# EAGLE design eeprom_emu_bt_satland (EAGLE 7.6.0)
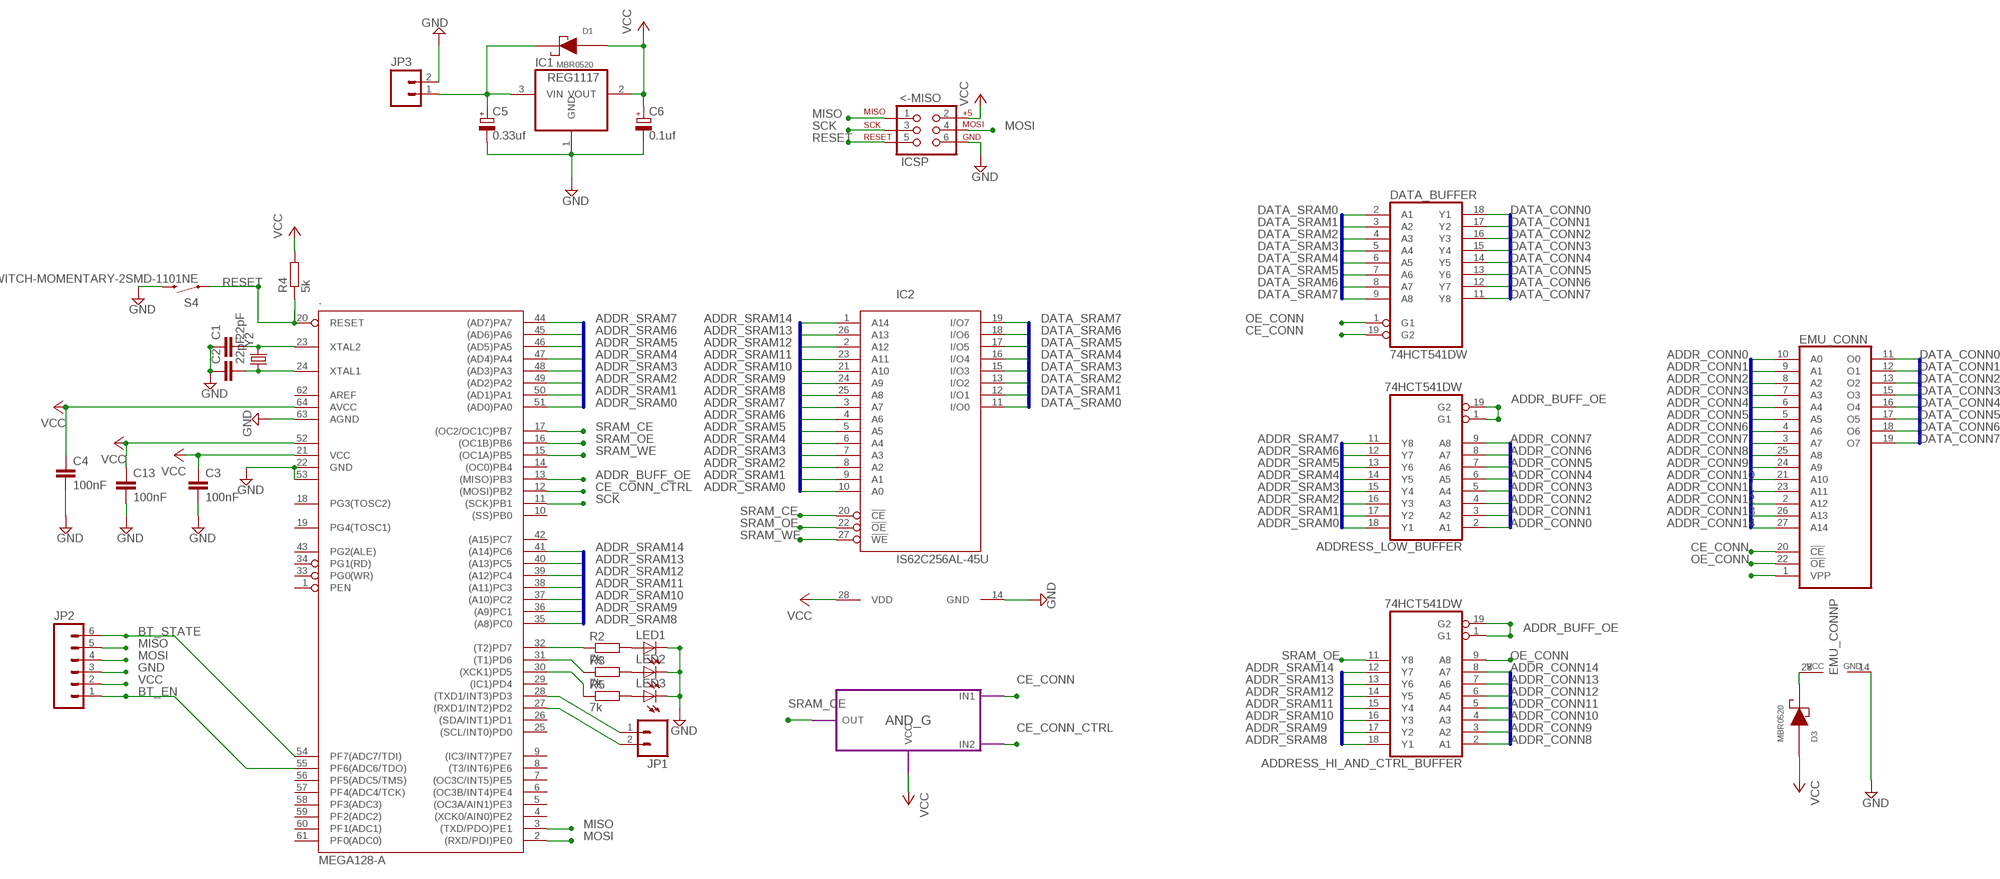
[diagram p0: schematic, sheet 1]

## Parts
.  MEGA128-A  [TQFP64]
<-MISO  ICSP  AVR_SPI_PRG_6PTH  [2X3]
ADDRESS_HI_AND_CTRL_BUFFER  74HCT541DW  [SO20W]
ADDRESS_LOW_BUFFER  74HCT541DW  [SO20W]
C1  22pF  C-EUC0805  [C0805]
C2  22pF  C-EUC0805  [C0805]
C3  100nF  C-EUC0805  [C0805]
C4  100nF  C-EUC0805  [C0805]
C5  0.33uf  CPOL-EUE5-4  [E5-4]
C6  0.1uf  CPOL-EUE5-4  [E5-4]
C13  100nF  C-EUC0805  [C0805]
D1  MBR0520  [SOD-123]
D3  MBR0520  [SOD-123]
DATA_BUFFER  74HCT541DW  [SO20W]
EMU_CONN  27256  [DIL28]
IC1  REG1117  [SOT223]
IC2  IS62C256AL-45U  [SOP28-330MIL]
JP1  M02LOCK_LONGPADS  [1X02_LOCK_LONGPADS]
JP2  M06SILK_FEMALE_PTH  [1X06]
JP3  M02LOCK_LONGPADS  [1X02_LOCK_LONGPADS]
LED1  LEDSML0805  [SML0805]
LED2  LEDSML0805  [SML0805]
LED3  LEDSML0805  [SML0805]
R2  7k  R-EU_R0805  [R0805]
R3  7k  R-EU_R0805  [R0805]
R4  5k  R-EU_R0805  [R0805]
R5  7k  R-EU_R0805  [R0805]
S4  SWITCH-MOMENTARY-2SMD-1101NE  [TACTILE-SWITCH-1101NE]
Y2  CRYSTALHC49UV  [HC49U-V]

## Module instances
AND_G = OR_GATE

## Nets
ADDR_BUFF_OE: ..13((MISO)PB3) ADDRESS_HI_AND_CTRL_BUFFER.1(G1) ADDRESS_HI_AND_CTRL_BUFFER.19(G2) ADDRESS_LOW_BUFFER.1(G1) ADDRESS_LOW_BUFFER.19(G2)
ADDR_CONN0: ADDRESS_LOW_BUFFER.2(A1) EMU_CONN.10(A0)
ADDR_CONN1: ADDRESS_LOW_BUFFER.3(A2) EMU_CONN.9(A1)
ADDR_CONN2: ADDRESS_LOW_BUFFER.4(A3) EMU_CONN.8(A2)
ADDR_CONN3: ADDRESS_LOW_BUFFER.5(A4) EMU_CONN.7(A3)
ADDR_CONN4: ADDRESS_LOW_BUFFER.6(A5) EMU_CONN.6(A4)
ADDR_CONN5: ADDRESS_LOW_BUFFER.7(A6) EMU_CONN.5(A5)
ADDR_CONN6: ADDRESS_LOW_BUFFER.8(A7) EMU_CONN.4(A6)
ADDR_CONN7: ADDRESS_LOW_BUFFER.9(A8) EMU_CONN.3(A7)
ADDR_CONN8: ADDRESS_HI_AND_CTRL_BUFFER.2(A1) EMU_CONN.25(A8)
ADDR_CONN9: ADDRESS_HI_AND_CTRL_BUFFER.3(A2) EMU_CONN.24(A9)
ADDR_CONN10: ADDRESS_HI_AND_CTRL_BUFFER.4(A3) EMU_CONN.21(A10)
ADDR_CONN11: ADDRESS_HI_AND_CTRL_BUFFER.5(A4) EMU_CONN.23(A11)
ADDR_CONN12: ADDRESS_HI_AND_CTRL_BUFFER.6(A5) EMU_CONN.2(A12)
ADDR_CONN13: ADDRESS_HI_AND_CTRL_BUFFER.7(A6) EMU_CONN.26(A13)
ADDR_CONN14: ADDRESS_HI_AND_CTRL_BUFFER.8(A7) EMU_CONN.27(A14)
ADDR_SRAM0: ..51((AD0)PA0) ADDRESS_LOW_BUFFER.18(Y1) IC2.10(A0)
ADDR_SRAM1: ..50((AD1)PA1) ADDRESS_LOW_BUFFER.17(Y2) IC2.9(A1)
ADDR_SRAM2: ..49((AD2)PA2) ADDRESS_LOW_BUFFER.16(Y3) IC2.8(A2)
ADDR_SRAM3: ..48((AD3)PA3) ADDRESS_LOW_BUFFER.15(Y4) IC2.7(A3)
ADDR_SRAM4: ..47((AD4)PA4) ADDRESS_LOW_BUFFER.14(Y5) IC2.6(A4)
ADDR_SRAM5: ..46((AD5)PA5) ADDRESS_LOW_BUFFER.13(Y6) IC2.5(A5)
ADDR_SRAM6: ..45((AD6)PA6) ADDRESS_LOW_BUFFER.12(Y7) IC2.4(A6)
ADDR_SRAM7: ..44((AD7)PA7) ADDRESS_LOW_BUFFER.11(Y8) IC2.3(A7)
ADDR_SRAM8: ..35((A8)PC0) ADDRESS_HI_AND_CTRL_BUFFER.18(Y1) IC2.25(A8)
ADDR_SRAM9: ..36((A9)PC1) ADDRESS_HI_AND_CTRL_BUFFER.17(Y2) IC2.24(A9)
ADDR_SRAM10: ..37((A10)PC2) ADDRESS_HI_AND_CTRL_BUFFER.16(Y3) IC2.21(A10)
ADDR_SRAM11: ..38((A11)PC3) ADDRESS_HI_AND_CTRL_BUFFER.15(Y4) IC2.23(A11)
ADDR_SRAM12: ..39((A12)PC4) ADDRESS_HI_AND_CTRL_BUFFER.14(Y5) IC2.2(A12)
ADDR_SRAM13: ..40((A13)PC5) ADDRESS_HI_AND_CTRL_BUFFER.13(Y6) IC2.26(A13)
ADDR_SRAM14: ..41((A14)PC6) ADDRESS_HI_AND_CTRL_BUFFER.12(Y7) IC2.1(A14)
BT_EN: ..55(PF6(ADC6/TDO)) JP2.1
BT_STATE: ..54(PF7(ADC7/TDI)) JP2.6
CE_CONN: DATA_BUFFER.19(G2) EMU_CONN.20(!CE) ; port AND_G.IN1
CE_CONN_CTRL: ..12((MOSI)PB2) ; port AND_G.IN2
DATA_CONN0: DATA_BUFFER.18(Y1) EMU_CONN.11(O0)
DATA_CONN1: DATA_BUFFER.17(Y2) EMU_CONN.12(O1)
DATA_CONN2: DATA_BUFFER.16(Y3) EMU_CONN.13(O2)
DATA_CONN3: DATA_BUFFER.15(Y4) EMU_CONN.15(O3)
DATA_CONN4: DATA_BUFFER.14(Y5) EMU_CONN.16(O4)
DATA_CONN5: DATA_BUFFER.13(Y6) EMU_CONN.17(O5)
DATA_CONN6: DATA_BUFFER.12(Y7) EMU_CONN.18(O6)
DATA_CONN7: DATA_BUFFER.11(Y8) EMU_CONN.19(O7)
DATA_SRAM0: DATA_BUFFER.2(A1) IC2.11(I/O0)
DATA_SRAM1: DATA_BUFFER.3(A2) IC2.12(I/O1)
DATA_SRAM2: DATA_BUFFER.4(A3) IC2.13(I/O2)
DATA_SRAM3: DATA_BUFFER.5(A4) IC2.15(I/O3)
DATA_SRAM4: DATA_BUFFER.6(A5) IC2.16(I/O4)
DATA_SRAM5: DATA_BUFFER.7(A6) IC2.17(I/O5)
DATA_SRAM6: DATA_BUFFER.8(A7) IC2.18(I/O6)
DATA_SRAM7: DATA_BUFFER.9(A8) IC2.19(I/O7)
GND: ..22(GND) ..53(GND1) ..63(AGND) <-MISO.6 C1.1 C2.1 C3.2 C4.2 C5.- C6.- C13.2 EMU_CONN.14(GND) IC1.1(GND) IC2.14(GND) JP2.3 JP3.2 LED1.C LED2.C LED3.C S4.2
MISO: ..3((TXD/PDO)PE1) <-MISO.1 JP2.5
MOSI: ..2((RXD/PDI)PE0) <-MISO.4 JP2.4
N$1: ..24(XTAL1) C2.2 Y2.1
N$2: ..23(XTAL2) C1.2 Y2.2
N$3: C5.+ D1.1(CA) IC1.3(VIN) JP3.1
N$4: D3.1(CA) EMU_CONN.28(VCC)
N$5: ..28((TXD1/INT3)PD3) JP1.1
N$6: ..32((T2)PD7) R2.1
N$7: LED1.A R2.2
N$8: ..31((T1)PD6) R3.1
N$9: EMU_CONN.1(VPP)
N$10: LED2.A R3.2
N$11: ..30((XCK1)PD5) R5.1
N$12: LED3.A R5.2
N$13: ..27((RXD1/INT2)PD2) JP1.2
OE_CONN: ADDRESS_HI_AND_CTRL_BUFFER.9(A8) DATA_BUFFER.1(G1) EMU_CONN.22(!OE)
RESET: ..20(RESET) <-MISO.5 R4.1 S4.1
SCK: ..11((SCK)PB1) <-MISO.3
SRAM_CE: ..17((OC2/OC1C)PB7) IC2.20(!CE) ; port AND_G.OUT
SRAM_OE: ..16((OC1B)PB6) ADDRESS_HI_AND_CTRL_BUFFER.11(Y8) IC2.22(!OE)
SRAM_WE: ..15((OC1A)PB5) IC2.27(!WE)
VCC: ..21(VCC) ..52(VCC1) ..64(AVCC) <-MISO.2 C3.1 C4.1 C6.+ C13.1 D1.2(AN) D3.2(AN) IC1.2(VOUT) IC2.28(VDD) JP2.2 R4.2 ; port AND_G.VCC
Unconnected: ..1(PEN) ..4((XCK0/AIN0)PE2) ..5((OC3A/AIN1)PE3) ..6((OC3B/INT4)PE4) ..7((OC3C/INT5)PE5) ..8((T3/INT6)PE6) ..9((IC3/INT7)PE7) ..10((SS)PB0) ..14((OC0)PB4) ..18(PG3(TOSC2)) ..19(PG4(TOSC1)) ..25((SCL/INT0)PD0) ..26((SDA/INT1)PD1) ..29((IC1)PD4) ..33(PG0(WR)) ..34(PG1(RD)) ..42((A15)PC7) ..43(PG2(ALE)) ..56(PF5(ADC5/TMS)) ..57(PF4(ADC4/TCK)) ..58(PF3(ADC3)) ..59(PF2(ADC2)) ..60(PF1(ADC1)) ..61(PF0(ADC0)) ..62(AREF)

## Buses
ADDR_SRAM[0..14]
DATA_SRAM[0..7]
DATA_CONN[0..7]
ADDR_CONN[0..7]
ADDR_CONN[8..14]
ADDR_SRAM[0..7]
ADDR_SRAM[8..14]
ADDR_CONN[0..14]

## Power pins joined to a net without a drawn wire
GND: ADDRESS_HI_AND_CTRL_BUFFER.10(GND) ADDRESS_LOW_BUFFER.10(GND) DATA_BUFFER.10(GND)
VCC: ADDRESS_HI_AND_CTRL_BUFFER.20(VCC) ADDRESS_LOW_BUFFER.20(VCC) DATA_BUFFER.20(VCC)

## Library data of the parts
. = avr-7:MEGA128: MICROCONTROLLER 128 Kbytes FLASH 4 Kbytes SRAM 4 Kbytes EEPROM DUAL USART 8-channel 10 bit ADC
<-MISO = SparkFun-Connectors:AVR_SPI_PRG_6: AVR ISP 6 Pin This is the reduced ISP connector for AVR programming. Common on Arduino. This footprint will take up less PCB space and can be used with a 10-pin to 6-pin adapter such as SKU: BOB-08508 **Special note about "TEST_POINT" package. The stop mask is on the top side, so if you want your programming test points to be on the bottom of your board, make sure to place this package on the bottom side of the board. This also ensure that the orientation to program from the bottom side will be correct.
ADDRESS_HI_AND_CTRL_BUFFER ADDRESS_LOW_BUFFER DATA_BUFFER = 74xx-eu:74*541: Octal BUFFER and LINE DRIVER, 3-state
C1-C4 C13 = resistor:C-EU: CAPACITOR, European symbol
C5 C6 = rcl:CPOL-EU: POLARIZED CAPACITOR, European symbol
D1 D3 = MySMD:MBR0520
EMU_CONN = memory:27256: MEMORY
IC1 = burr-brown:REG1117: 800mA and 1A Low Dropout (LDO) Positive Regulator 1.8V, 2.5V, 2.85V, 3.3V, 5V, and Adj; MPN: REG1117; OC_FARNELL: 1097566; OC_NEWARK: 14P6981
IC2 = memory-issi-asynsram:IS62C256AL-*: 32k x 8 low power CMOS static RAM 25ns and 45ns access time 5V power supply
JP1 JP3 = SparkFun-Connectors:M02: Standard 2-pin 0.1" header. Use with - straight break away headers ( PRT-00116) - right angle break away headers (PRT-00553) - swiss pins (PRT-00743) - machine pins (PRT-00117) - female headers (PRT-00115) Molex polarized connector foot print use with: PRT-08233 with associated crimp pins and housings. 2.54_SCREWTERM for use with PRT-10571. 3.5mm Screw Terminal footprints for PRT-08084 5mm Screw Terminal footprints for use with PRT-08432
JP2 = SparkFun-Connectors:M06: Header 6 Standard 6-pin 0.1" header. Use with straight break away headers (SKU : PRT-00116), right angle break away headers (PRT-00553), swiss pins (PRT-00743), machine pins (PRT-00117), and female headers (PRT-00115). Molex polarized connector foot print use with SKU : PRT-08094 with associated crimp pins and housings. NOTES ON THE VARIANTS LOCK and LOCK_LONGPADS... This footprint was designed to help hold the alignment of a through-hole component (i.e. 6-pin header) while soldering it into place. You may notice that each hole has been shifted either up or down by 0.005 of an inch from it's more standard position (which is a perfectly straight line). This slight alteration caused the pins (the squares in the middle) to touch the edges of the holes. Because they are alternating, it causes a "brace" to hold the component in place. 0.005 has proven to be the perfect amount of "off-center" position when using our standard breakaway headers. Although looks a little odd when you look at the bare footprint, once you have a header in there, the alteration is very hard to notice. Also,if you push a header all the way into place, it is covered up entirely on the bottom side. This idea of altering the position of holes to aid alignment will be further integrated into the Sparkfun Library for other footprints. It can help hold any component with 3 or more connection pins.; PROD_ID: CONN-08437
LED1-LED3 = led:LED: LED OSRAM: - CHIPLED LG R971, LG N971, LY N971, LG Q971, LY Q971, LO R971, LY R971 LH N974, LH R974 LS Q976, LO Q976, LY Q976 LO Q996 - Hyper CHIPLED LW Q18S LB Q993, LB Q99A, LB R99A - SideLED LS A670, LO A670, LY A670, LG A670, LP A670 LB A673, LV A673, LT A673, LW A673 LH A674 LY A675 LS A676, LA A676, LO A676, LY A676, LW A676 LS A679, LY A679, LG A679 - Hyper Micro SIDELED® LS Y876, LA Y876, LO Y876, LY Y876 LT Y87S - SmartLED LW L88C, LW L88S LB L89C, LB L89S, LG L890 LS L89K, LO L89K, LY L89K LS L896, LA L896, LO L896, LY L896 - TOPLED LS T670, LO T670, LY T670, LG T670, LP T670 LSG T670, LSP T670, LSY T670, LOP T670, LYG T670 LG T671, LOG T671, LSG T671 LB T673, LV T673, LT T673, LW T673 LH T674 LS T676, LA T676, LO T676, LY T676, LB T676, LH T676, LSB T676, LW T676 LB T67C, LV T67C, LT T67C, LS T67K, LO T67K, LY T67K, LW E67C LS E67B, LA E67B, LO E67B, LY E67B, LB E67C, LV E67C, LT E67C LW T67C LS T679, LY T679, LG T679 LS T770, LO T770, LY T770, LG T770, LP T770 LB T773, LV T773, LT T773, LW T773 LH T774 LS E675, LA E675, LY E675, LS T675 LS T776, LA T776, LO T776, LY T776, LB T776 LHGB T686 LT T68C, LB T68C - Hyper Mini TOPLED® LB M676 - Mini TOPLED Santana® LG M470 LS M47K, LO M47K, LY M47K Source: http://www.osram.convergy.de LUXEON: - LUMILED® LXK2-PW12-R00, LXK2-PW12-S00, LXK2-PW14-U00, LXK2-PW14-V00 LXK2-PM12-R00, LXK2-PM12-S00, LXK2-PM14-U00 LXK2-PE12-Q00, LXK2-PE12-R00, LXK2-PE12-S00, LXK2-PE14-T00, LXK2-PE14-U00 LXK2-PB12-K00, LXK2-PB12-L00, LXK2-PB12-M00, LXK2-PB14-N00, LXK2-PB14-P00, LXK2-PB14-Q00 LXK2-PR12-L00, LXK2-PR12-M00, LXK2-PR14-Q00, LXK2-PR14-R00 LXK2-PD12-Q00, LXK2-PD12-R00, LXK2-PD12-S00 LXK2-PH12-R00, LXK2-PH12-S00 LXK2-PL12-P00, LXK2-PL12-Q00, LXK2-PL12-R00 Source: www.luxeon.com KINGBRIGHT: KA-3528ASYC Source: www.kingbright.com
R2-R5 = rcl:R-EU_: RESISTOR, European symbol
S4 = SparkFun-Electromechanical:SWITCH-MOMENTARY-2: Various NO switches- pushbuttons, reed, etc; PROD_ID: SWCH-00815
Y2 = SparkFun-FreqCtrl:CRYSTAL: Various standard crystals. Proven footprints.

## Module OR_GATE
Ports: IN1(in) IN2(in) VCC(pwr) OUT(out)
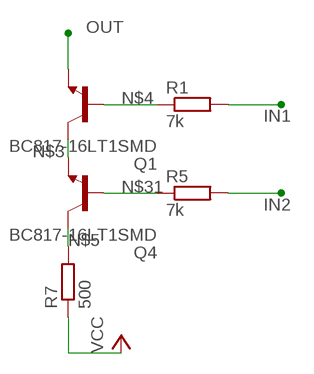
[diagram p1: schematic, module OR_GATE, sheet 1]

### Parts
Q1  BC817-16LT1SMD  [SOT23-BEC]
Q4  BC817-16LT1SMD  [SOT23-BEC]
R1  7k  R-EU_R0805  [R0805]
R5  7k  R-EU_R0805  [R0805]
R7  500  R-EU_R0805  [R0805]

### Nets
IN1: R1.2
IN2: R5.2
N$3: Q1.C Q4.E
N$4: Q1.B R1.1
N$5: Q4.C R7.2
N$31: Q4.B R5.1
OUT: Q1.E
VCC: R7.1

### Library data of the parts
Q1 Q4 = transistor-npn:BC817*: NPN Transistor
R1 R5 R7 = rcl:R-EU_: RESISTOR, European symbol

## Board
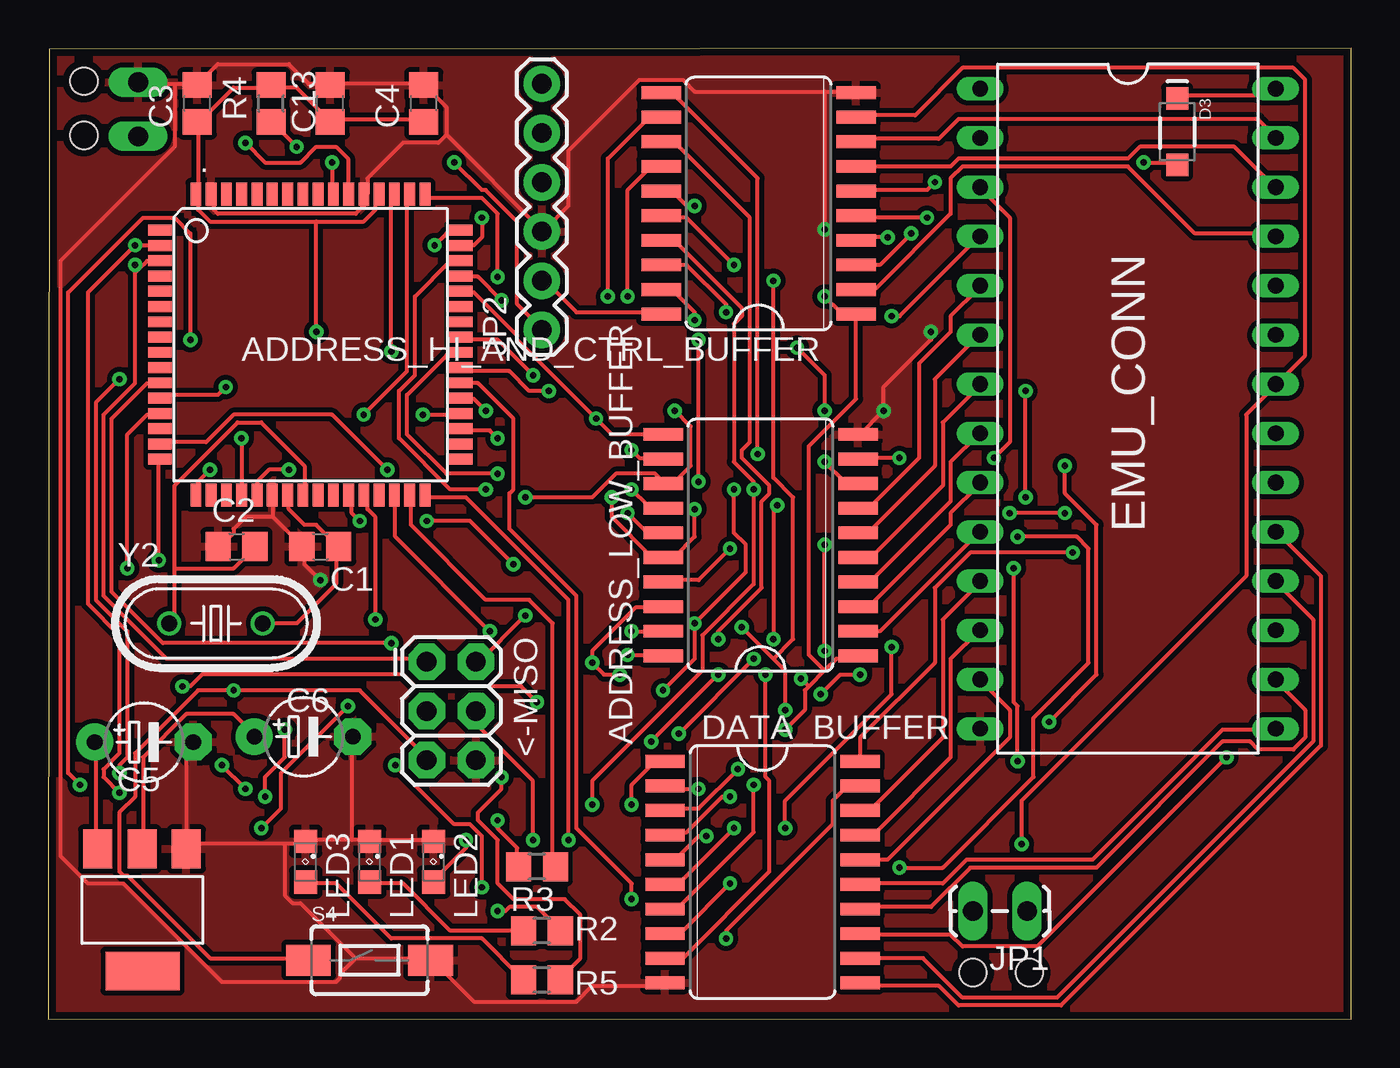
[diagram p2: board, top side]
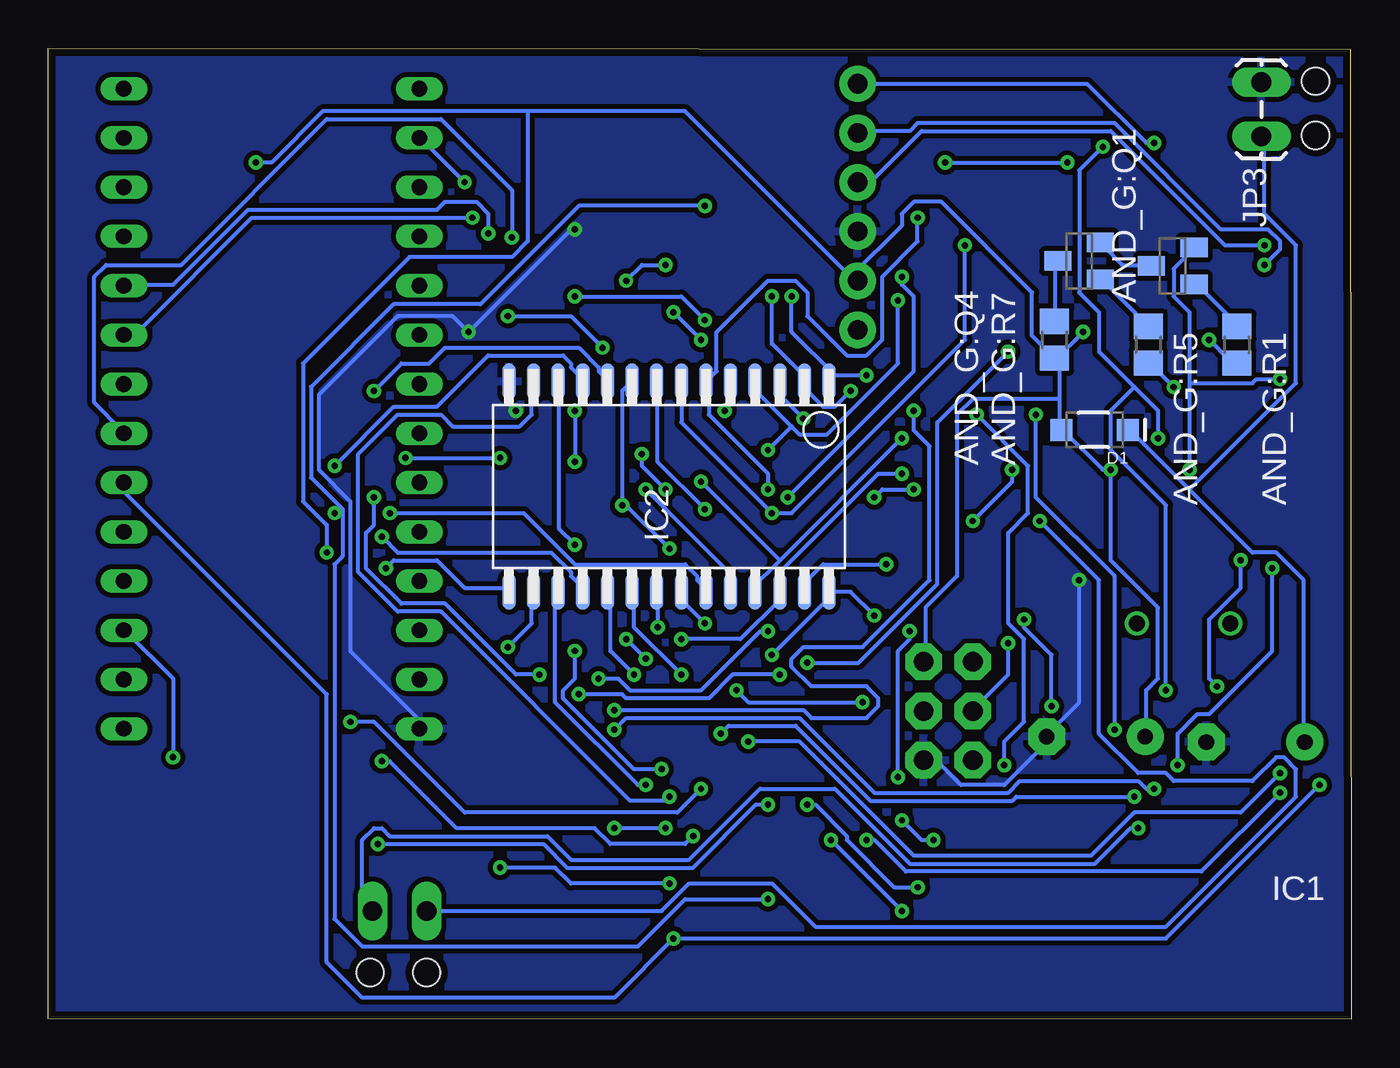
[diagram p3: board, bottom side, seen from below]

Size 67.18 x 50.08 mm. Coordinates in mm from the lower left corner, seen from the top.
Outline: 0,0 67.18,0.02 67.18,50.08 0.05,50.03 0,0
Copper layers (1*16): Top 0.0356mm / dielectric 1.5011mm / Bottom 0.0356mm
Design rules "oshpark-2layer *": minimum track width 8mil, minimum drill 13mil, track to track 8mil, track to pad 8mil, pad to pad 8mil, via to via 8mil, smd to smd 6mil, copper to edge 15mil, drill to drill 6mil, minimum pad ring 8mil, minimum via ring 8mil, stop-mask expansion 2.5mil, vias tented up to drill 0mil, thermal gap 10mil
Holes 1.4 mm at 1.83,48.39 1.83,45.59 47.68,2.41 50.6,2.41

### Footprints (pad centres in the part's own frame; a part is rotated, then mirrored left to right if it is on the bottom)
TQFP64 = smd 1.194 x 0.559: 1 -7.76,5.905; 2 -7.76,5.118; 3 -7.76,4.331; 4 -7.76,3.543; 5 -7.76,2.756; 6 -7.76,1.968; 7 -7.76,1.181; 8 -7.76,0.394; 9 -7.76,-0.394; 10 -7.76,-1.181; 11 -7.76,-1.968; 12 -7.76,-2.756; 13 -7.76,-3.543; 14 -7.76,-4.331; 15 -7.76,-5.118; 16 -7.76,-5.905; 33 7.76,-5.905; 34 7.76,-5.118; 35 7.76,-4.331; 36 7.76,-3.543; 37 7.76,-2.756; 38 7.76,-1.968; 39 7.76,-1.181; 40 7.76,-0.394; 41 7.76,0.394; 42 7.76,1.181; 43 7.76,1.968; 44 7.76,2.756; 45 7.76,3.543; 46 7.76,4.331; 47 7.76,5.118; 48 7.76,5.905 | smd 0.559 x 1.194: 17 -5.905,-7.76; 18 -5.118,-7.76; 19 -4.331,-7.76; 20 -3.543,-7.76; 21 -2.756,-7.76; 22 -1.968,-7.76; 23 -1.181,-7.76; 24 -0.394,-7.76; 25 0.394,-7.76; 26 1.181,-7.76; 27 1.968,-7.76; 28 2.756,-7.76; 29 3.543,-7.76; 30 4.331,-7.76; 31 5.118,-7.76; 32 5.905,-7.76; 49 5.905,7.76; 50 5.118,7.76; 51 4.331,7.76; 52 3.543,7.76; 53 2.756,7.76; 54 1.968,7.76; 55 1.181,7.76; 56 0.394,7.76; 57 -0.394,7.76; 58 -1.181,7.76; 59 -1.968,7.76; 60 -2.756,7.76; 61 -3.543,7.76; 62 -4.331,7.76; 63 -5.118,7.76; 64 -5.905,7.76
2X3 = drill 1.016 pad 1.88 octagon: 1 0,0; 2 0,2.54; 3 2.54,0; 4 2.54,2.54; 5 5.08,0; 6 5.08,2.54
SO20W = smd 0.66 x 2.032: 1 -5.715,-5.029; 2 -4.445,-5.029; 3 -3.175,-5.029; 4 -1.905,-5.029; 5 -0.635,-5.029; 6 0.635,-5.029; 7 1.905,-5.029; 8 3.175,-5.029; 9 4.445,-5.029; 10 5.715,-5.029; 11 5.715,5.029; 12 4.445,5.029; 13 3.175,5.029; 14 1.905,5.029; 15 0.635,5.029; 16 -0.635,5.029; 17 -1.905,5.029; 18 -3.175,5.029; 19 -4.445,5.029; 20 -5.715,5.029
SOT23-BEC = smd 1 x 1.4: B -0.95,-1.1; C 0,1.1; E 0.95,-1.1
R0805 = smd 1.3 x 1.5: 1 -0.95,0; 2 0.95,0
C0805 = smd 1.3 x 1.5: 1 -0.95,0; 2 0.95,0
E5-4 = drill 0.813 pad 1.905: + -2.54,0 | drill 0.813 pad 1.905 octagon: - 2.54,0
SOD-123 = smd 1.143 x 1.143: 1 0,0; 2 3.429,0
DIL28 = drill 0.813 long: 1 -16.51,-7.62; 2 -13.97,-7.62; 3 -11.43,-7.62; 4 -8.89,-7.62; 5 -6.35,-7.62; 6 -3.81,-7.62; 7 -1.27,-7.62; 8 1.27,-7.62; 9 3.81,-7.62; 10 6.35,-7.62; 11 8.89,-7.62; 12 11.43,-7.62; 13 13.97,-7.62; 14 16.51,-7.62; 15 16.51,7.62; 16 13.97,7.62; 17 11.43,7.62; 18 8.89,7.62; 19 6.35,7.62; 20 3.81,7.62; 21 1.27,7.62; 22 -1.27,7.62; 23 -3.81,7.62; 24 -6.35,7.62; 25 -8.89,7.62; 26 -11.43,7.62; 27 -13.97,7.62; 28 -16.51,7.62
SOT223 = smd 1.499 x 2.007: 1 -2.261,-3.15; 2 0.025,-3.15; 3 2.311,-3.15 | smd 3.81 x 2.007: 4 0,3.15
SOP28-330MIL = smd 0.7 x 1.9: 1 -8.255,-5.415; 2 -6.985,-5.415; 3 -5.715,-5.415; 4 -4.445,-5.415; 5 -3.175,-5.415; 6 -1.905,-5.415; 7 -0.635,-5.415; 8 0.635,-5.415; 9 1.905,-5.415; 10 3.175,-5.415; 11 4.445,-5.415; 12 5.715,-5.415; 13 6.985,-5.415; 14 8.255,-5.415; 15 8.255,5.415; 16 6.985,5.415; 17 5.715,5.415; 18 4.445,5.415; 19 3.175,5.415; 20 1.905,5.415; 21 0.635,5.415; 22 -0.635,5.415; 23 -1.905,5.415; 24 -3.175,5.415; 25 -4.445,5.415; 26 -5.715,5.415; 27 -6.985,5.415; 28 -8.255,5.415
1X02_LOCK_LONGPADS = drill 1.016 long: 1 -0.127,0; 2 2.667,0
1X06 = drill 1.016 pad 1.88: 1 0,0; 2 2.54,0; 3 5.08,0; 4 7.62,0; 5 10.16,0; 6 12.7,0
SML0805 = smd 1.2 x 1.2: A 1.05,0; C -1.05,0
TACTILE-SWITCH-1101NE = smd 2.3 x 1.6: 1 -3.15,0; 2 3.15,0
HC49U-V = drill 0.813: 1 -2.413,0; 2 2.413,0

### Placement (x,y rotation side)
.  13.51,34.8 0 top
<-MISO  19.51,18.44 270 top
ADDRESS_HI_AND_CTRL_BUFFER  36.63,42.09 90 top
ADDRESS_LOW_BUFFER  36.73,24.46 90 top
AND_G:Q1  BC817-16LT1SMD  [SOT23-BEC]  9.19,38.86 90 bottom
AND_G:Q4  BC817-16LT1SMD  [SOT23-BEC]  14.02,39.12 90 bottom
AND_G:R1  7k  [R0805]  5.89,34.8 270 bottom
AND_G:R5  7k  [R0805]  10.46,34.8 270 bottom
AND_G:R7  500  [R0805]  15.29,35.05 90 bottom
C1  14.02,24.38 0 top
C2  9.7,24.38 0 top
C3  7.67,47.24 90 top
C4  19.35,47.24 90 top
C5  4.93,14.3 0 top
C6  13.16,14.58 0 top
C13  14.53,47.24 90 top
D1  11.51,30.4 180 bottom
D3  58.22,47.5 270 top
DATA_BUFFER  36.83,7.59 270 top
EMU_CONN  55.68,31.5 270 top
IC1  4.85,5.64 180 top
IC2  35.18,27.48 180 bottom
JP1  50.34,5.59 180 top
JP2  25.45,35.56 90 top
JP3  4.62,45.67 90 bottom
LED1  16.56,8.13 270 top
LED2  19.86,8.13 270 top
LED3  13.26,8.13 270 top
R2  25.45,4.57 180 top
R3  25.2,7.87 180 top
R4  11.48,47.24 90 top
R5  25.45,2.03 180 top
S4  16.56,3.05 0 top
Y2  8.64,20.42 0 top

### Tracks (layer width: path | path; a pad name or v marks a point on that pad's centre or on a via)
ADDR_BUFF_OE  (via drill 0.33)
  Top 0.203: v4.06,23.27 4.06,30.17 5.08,31.19 5.69,31.19 ..13 | v10.16,11.89 v8.94,13.11 | v38,14.93 39.01,15.95 39.01,16.97 39.22,17.17 | 40.03,17.98 40.64,18.59 41.66,18.59 ADDRESS_LOW_BUFFER.1 | 40.03,17.98 39.22,17.17 | v30.07,20.02 ADDRESS_LOW_BUFFER.19 | 39.22,17.17 v38.81,17.58 | 40.03,17.98 39.22,18.8 39.22,29.57 41.66,32 ADDRESS_HI_AND_CTRL_BUFFER.1 41.66,36.47 40.84,36.47 v40.03,37.29 | v33.32,36.07 33.32,36.47 32.31,37.49 31.7,37.49 ADDRESS_HI_AND_CTRL_BUFFER.19
  Bottom 0.203: v4.06,23.27 4.06,19 7.31,15.75 7.92,15.75 8.94,14.73 v8.94,13.11 | v10.16,11.89 10.57,11.89 10.97,12.29 17.07,12.29 17.68,11.68 24.59,11.68 28.45,15.55 37.39,15.55 v38,14.93 | v30.07,20.02 30.48,20.02 33.53,16.97 37.19,16.97 37.79,17.58 v38.81,17.58 | v33.32,36.07 34.54,37.29 v40.03,37.29
ADDR_CONN0
  Top 0.203: ADDRESS_LOW_BUFFER.2 42.87,20.02 47.95,25.09 EMU_CONN.10
ADDR_CONN1
  Top 0.203: ADDRESS_LOW_BUFFER.3 41.86,21.44 42.47,21.44 46.53,25.5 46.53,26.11 47.95,27.53 EMU_CONN.9
ADDR_CONN2
  Top 0.203: ADDRESS_LOW_BUFFER.4 41.86,22.66 42.47,22.66 46.53,26.72 46.53,28.75 47.95,30.17 EMU_CONN.8
ADDR_CONN3
  Top 0.203: ADDRESS_LOW_BUFFER.5 41.86,23.88 42.47,23.88 46.13,27.53 46.13,30.78 47.95,32.61 EMU_CONN.7
ADDR_CONN4
  Top 0.203: ADDRESS_LOW_BUFFER.6 42.27,25.09 45.72,28.55 45.72,33.02 47.95,35.26 EMU_CONN.6
ADDR_CONN5
  Top 0.203: ADDRESS_LOW_BUFFER.7 41.86,26.52 42.47,26.52 44.91,28.96 44.91,33.83 46.53,35.46 46.53,36.27 47.95,37.69 EMU_CONN.5
ADDR_CONN6  (via drill 0.33)
  Top 0.203: v40.03,28.75 41.05,27.74 41.66,27.74 ADDRESS_LOW_BUFFER.8 | v40.03,31.39 40.03,33.22 v38.61,34.65 | v43.48,36.27 43.89,36.27 47.95,40.34 EMU_CONN.4
  Bottom 0.203: v40.03,31.39 v40.03,28.75 | v38.61,34.65 40.23,36.27 v43.48,36.27
ADDR_CONN7  (via drill 0.33)
  Top 0.203: v43.89,28.96 41.86,28.96 ADDRESS_LOW_BUFFER.9 | v48.77,28.96 49.58,29.77 49.58,41.35 48.16,42.77 EMU_CONN.3
  Bottom 0.203: v48.77,28.96 v43.89,28.96
ADDR_CONN8
  Top 0.203: ADDRESS_HI_AND_CTRL_BUFFER.2 41.66,37.69 42.67,37.69 46.53,41.55 46.53,43.38 47.14,43.99 55.68,43.99 59.13,40.54 63.19,40.54 EMU_CONN.25
ADDR_CONN9  (via drill 0.33)
  Top 0.203: ADDRESS_HI_AND_CTRL_BUFFER.3 42.87,38.91 v44.5,40.54
  Bottom 0.203: v44.5,40.54 44.5,41.55 45.11,42.16 46.74,42.16 47.14,41.76 56.9,41.76 60.76,37.9 63.19,37.9 EMU_CONN.24
ADDR_CONN10  (via drill 0.33)
  Top 0.203: v43.28,40.34 41.66,40.34 ADDRESS_HI_AND_CTRL_BUFFER.4
  Bottom 0.203: v43.28,40.34 43.28,42.77 46.94,46.43 52.83,46.43 60.35,38.91 64.21,38.91 64.82,38.3 64.82,31.8 63.4,30.38 EMU_CONN.21
ADDR_CONN11  (via drill 0.33)
  Top 0.203: v45.31,41.35 41.66,41.35 ADDRESS_HI_AND_CTRL_BUFFER.5
  Bottom 0.203: v45.31,41.35 56.69,41.35 62.59,35.46 63.19,35.46 EMU_CONN.23
ADDR_CONN12  (via drill 0.33)
  Top 0.203: v45.72,43.18 45.31,42.77 41.66,42.77 ADDRESS_HI_AND_CTRL_BUFFER.6
  Bottom 0.203: v45.72,43.18 47.95,45.41 EMU_CONN.2
ADDR_CONN13
  Top 0.203: ADDRESS_HI_AND_CTRL_BUFFER.7 46.53,43.99 46.94,44.4 55.68,44.4 56.29,45.01 61.16,45.01 63.19,42.98 EMU_CONN.26
ADDR_CONN14
  Top 0.203: ADDRESS_HI_AND_CTRL_BUFFER.8 41.66,45.41 45.92,45.41 46.94,46.43 62.38,46.43 63.19,45.62 EMU_CONN.27
ADDR_SRAM0  (via drill 0.33)
  Top 0.203: v17.68,34.44 17.68,42.37 ..51 | ADDRESS_LOW_BUFFER.18 31.7,21.23 30.28,21.23 28.04,19 v28.04,18.39 28.65,17.78 v29.46,17.78 | v50.39,26.92 v50.39,32.41 | v41.86,17.78 40.84,17.78 v39.83,16.76
  Bottom 0.203: v17.68,34.44 21.34,30.78 21.34,22.45 25.4,18.39 v28.04,18.39 | v50.39,32.41 48.97,33.83 47.55,33.83 46.74,34.65 39.83,34.65 38.81,33.63 38.81,33.43 38.4,33.02 IC2.10 | v50.39,26.92 50.39,25.5 50.8,25.09 50.8,23.27 48.97,21.44 46.74,21.44 43.08,17.78 v41.86,17.78 | v39.83,16.76 37.59,16.76 37.39,16.56 33.12,16.56 31.9,17.78 v29.46,17.78
ADDR_SRAM1  (via drill 0.33)
  Top 0.203: v16.26,31.19 18.49,33.43 18.49,42.37 ..50 | v12.19,14.93 12.19,13.51 11.18,12.5 v11.18,11.48 | v36.37,18.59 v32.51,14.73 | v37.39,19.61 37.39,26.31 v37.59,26.52 | v35.15,24.28 33.53,22.66 31.7,22.66 ADDRESS_LOW_BUFFER.17
  Bottom 0.203: v16.26,31.19 16.26,26.92 12.19,22.86 v12.19,14.93 | v11.18,11.48 17.27,11.48 17.47,11.28 24.79,11.28 28.65,15.14 32.11,15.14 v32.51,14.73 | v37.39,19.61 v36.37,18.59 | 37.59,26.72 37.59,32.41 37.19,32.82 IC2.9 | 37.59,26.72 v35.15,24.28 | 37.59,26.72 v37.59,26.52
ADDR_SRAM2  (via drill 0.33)
  Top 0.203: v23.16,38.3 23.16,41.55 22.35,42.37 19.51,42.37 ..49 | v29.06,26.92 29.06,25.91 31.09,23.88 31.7,23.88 | v33.32,26.31 33.32,24.89 32.31,23.88 31.7,23.88 | 31.7,23.88 ADDRESS_LOW_BUFFER.16
  Bottom 0.203: v23.16,38.3 23.16,37.9 22.55,37.29 22.55,33.43 v29.06,26.92 | v33.32,26.31 35.76,28.75 35.76,32.82 IC2.8
ADDR_SRAM3  (via drill 0.33)
  Top 0.203: v19.91,39.93 20.52,40.54 21.13,40.54 ..48 | ADDRESS_LOW_BUFFER.15 30.89,25.09 v29.87,26.11
  Bottom 0.203: v19.91,39.93 19.91,35.05 28.85,26.11 v29.87,26.11 34.54,30.78 IC2.7
ADDR_SRAM4  (via drill 0.33)
  Top 0.203: v22.35,41.35 22.35,40.34 21.95,39.93 21.34,39.93 ..47 | v30.07,27.33 30.89,26.52 31.7,26.52 ADDRESS_LOW_BUFFER.14
  Bottom 0.203: v22.35,41.35 22.35,40.13 24.18,38.3 24.18,35.05 24.99,34.24 26.01,34.24 28.04,36.27 28.04,37.49 28.65,38.1 30.07,38.1 32.71,35.46 32.71,33.43 33.12,33.02 IC2.6 33.12,32.82 33.12,31.19 30.07,28.14 v30.07,27.33
ADDR_SRAM5  (via drill 0.33)
  Top 0.203: v22.55,27.33 20.73,27.33 18.08,29.97 18.08,32.41 18.9,33.22 18.9,37.29 20.73,39.12 21.13,39.12 ..46 | v24.59,26.92 28.04,26.92 29.26,28.14 31.29,28.14 31.7,27.74 | v32.31,31.39 33.12,30.58 33.12,28.55 32.31,27.74 31.7,27.74 | 31.7,27.74 ADDRESS_LOW_BUFFER.13
  Bottom 0.203: v22.55,27.33 24.18,27.33 v24.59,26.92 | v32.31,31.39 32.11,31.6 32.11,32.82 IC2.5
ADDR_SRAM6  (via drill 0.33)
  Top 0.203: v23.37,37.08 22.15,38.3 21.34,38.3 ..45 | v30.07,29.36 30.48,28.96 31.7,28.96 ADDRESS_LOW_BUFFER.12
  Bottom 0.203: v23.37,37.08 23.37,33.83 27.03,30.17 28.45,30.17 28.85,30.58 | 28.85,30.58 30.68,32.41 30.68,32.82 IC2.4 | 28.85,30.58 v30.07,29.36
ADDR_SRAM7  (via drill 0.33)
  Top 0.203: ADDRESS_LOW_BUFFER.11 29.06,30.17 v28.24,30.99 24.18,35.05 24.18,35.26 21.95,37.49 21.34,37.49 ..44
  Bottom 0.203: IC2.3 29.46,32.21 v28.24,30.99
ADDR_SRAM8  (via drill 0.33)
  Top 0.203: v23.16,29.97 22.76,30.38 21.34,30.38 ..35 | ADDRESS_HI_AND_CTRL_BUFFER.18 32.92,38.91 34.95,36.88 v34.95,36.47 | v33.53,27.74 v33.53,35.05
  Bottom 0.203: 29.46,23.67 30.89,22.25 IC2.25 | 29.46,23.67 v23.16,29.97 | v33.53,35.05 v34.95,36.47 | 29.46,23.67 v33.53,27.74
ADDR_SRAM9  (via drill 0.33)
  Top 0.203: v19.3,31.19 21.13,31.19 ..36 | v17.88,13.11 20.93,10.06 21.74,10.06 22.35,9.45 v22.35,6.81 | v28.04,11.07 28.04,12.29 33.73,17.98 33.73,19.81 36.37,22.45 v36.37,27.33 36.37,27.74 35.36,28.75 35.36,35.87 35.76,36.27 35.76,36.68 32.31,40.13 31.7,40.13 ADDRESS_HI_AND_CTRL_BUFFER.17
  Bottom 0.203: v19.3,31.19 16.66,28.55 16.66,26.11 17.68,25.09 17.68,20.42 16.87,19.61 16.87,15.34 17.88,14.33 v17.88,13.11 | v22.35,6.81 23.57,6.81 26.01,9.25 26.01,9.45 27.63,11.07 v28.04,11.07 | v36.37,27.33 32.11,23.06 32.11,22.25 IC2.24
ADDR_SRAM10  (via drill 0.33)
  Top 0.203: v22.55,31.39 21.95,32 21.34,32 ..37 | v38,15.95 38,17.98 37.39,18.59 | v35.76,20.22 37.39,18.59 | v35.36,38.91 32.92,41.35 31.7,41.35 ADDRESS_HI_AND_CTRL_BUFFER.16 | v37.39,38.1 37.39,27.94 38.4,26.92 38.4,19.61 37.39,18.59
  Bottom 0.203: v22.55,31.39 22.55,30.38 21.74,29.57 21.74,22.66 25.2,19.2 28.24,19.2 28.85,18.59 28.85,18.19 27.84,17.17 24.99,17.17 24.38,16.56 24.38,16.15 24.99,15.55 27.84,15.55 28.24,15.95 v38,15.95 | v35.76,20.22 35.76,22.05 IC2.21 | v35.36,38.91 36.58,38.91 v37.39,38.1
ADDR_SRAM11  (via drill 0.33)
  Top 0.203: v30.07,6.2 30.07,7.01 27.23,9.85 27.23,21.84 23.77,25.3 23.77,27.13 23.98,27.33 23.98,30.99 22.15,32.82 21.34,32.82 ..38 | v33.32,41.96 32.92,41.96 32.31,42.57 31.7,42.57 ADDRESS_HI_AND_CTRL_BUFFER.15 | v52.43,26.11 v49.58,26.11
  Bottom 0.203: v30.07,6.2 34.34,6.2 36.78,3.76 51,3.76 52.43,5.18 52.43,23.47 52.02,23.88 52.02,26.11 | 52.02,26.11 52.02,26.31 53.64,27.94 53.64,32.61 49.38,36.88 44.91,36.88 39.83,41.96 v33.32,41.96 | v49.58,26.11 42.67,26.11 40.03,23.47 34.34,23.47 33.73,22.86 33.73,22.66 33.32,22.25 IC2.23 | 52.02,26.11 v52.43,26.11
ADDR_SRAM12  (via drill 0.33)
  Top 0.203: v25.81,32.41 24.79,32.41 23.77,33.43 21.34,33.43 ..39 | ADDRESS_HI_AND_CTRL_BUFFER.14 31.09,43.99 29.87,42.77 v29.87,37.29
  Bottom 0.203: v25.81,32.41 26.62,31.6 27.23,31.6 28.04,32.41 28.04,32.82 IC2.2 28.04,33.02 29.87,34.85 v29.87,37.29
ADDR_SRAM13  (via drill 0.33)
  Top 0.203: v23.16,28.14 20.52,28.14 18.49,30.17 18.49,32.21 20.52,34.24 21.13,34.24 ..40 | v34.54,19.61 34.54,20.02 36.78,22.25 36.78,26.72 37.19,27.13 37.19,27.53 35.76,28.96 35.76,29.36 36.17,29.77 36.17,41.35 32.31,45.21 31.7,45.21 ADDRESS_HI_AND_CTRL_BUFFER.13
  Bottom 0.203: v23.16,28.14 24.38,28.14 29.46,23.06 IC2.26 29.46,21.64 31.5,19.61 v34.54,19.61
ADDR_SRAM14  (via drill 0.33)
  Top 0.203: v24.99,33.22 23.16,35.05 21.34,35.05 ..41 | v28.85,37.29 28.85,44.4 30.89,46.43 31.5,46.43 ADDRESS_HI_AND_CTRL_BUFFER.12
  Bottom 0.203: 26.62,33.22 v24.99,33.22 | 26.62,33.22 26.82,33.02 IC2.1 26.62,33.22 | v28.85,37.29 28.85,35.46 26.62,33.22
AND_G:N$3
  Bottom 0.203: AND_G:Q1.C 10.36,38.91 11.79,38.91 12.8,39.93 AND_G:Q4.E
AND_G:N$4
  Bottom 0.203: AND_G:Q1.B 7.92,37.9 5.89,35.87 AND_G:R1.1
AND_G:N$5
  Bottom 0.203: AND_G:Q4.C 15.24,39.12 15.24,36.07 AND_G:R7.2
AND_G:N$31
  Bottom 0.203: AND_G:Q4.B 12.8,38.1 10.57,35.87 AND_G:R5.1
BT_EN  (via drill 0.33)
  Top 0.203: v14.63,44.2 14.63,42.57 ..55 | v20.93,44.2 22.35,42.77 22.55,42.77 24.18,41.15 24.18,36.88 25.4,35.66 JP2.1
  Bottom 0.203: v20.93,44.2 v14.63,44.2
BT_STATE  (via drill 0.33)
  Top 0.203: v10.16,45.21 11.18,44.2 13,44.2 13.82,45.01 14.83,45.01 15.44,44.4 15.44,42.57 ..54
  Bottom 0.203: v10.16,45.21 10.57,45.21 13.61,48.26 JP2.6
CE_CONN  (via drill 0.33)
  Top 0.203: v7.31,35.05 7.31,40.54 6.5,41.35 4.88,41.35 1.02,37.49 1.02,12.7 v1.63,12.09 | v34.95,4.17 34.95,4.57 40.44,10.06 40.44,11.28 41.05,11.89 41.86,11.89 DATA_BUFFER.19
  Bottom 0.203: v7.31,35.05 6.3,34.04 5.89,34.04 AND_G:R1.2 | v1.63,12.09 9.55,4.17 v34.95,4.17 38,1.12 51,1.12 52.83,2.95 52.83,16.76 63.19,27.13 63.19,27.53 EMU_CONN.20
CE_CONN_CTRL  (via drill 0.33)
  Top 0.203: v9.14,32.61 8.74,32.21 5.89,32.21 ..12
  Bottom 0.203: v9.14,32.61 10.36,33.83 AND_G:R5.2
DATA_CONN0
  Top 0.203: DATA_BUFFER.18 41.86,10.87 42.47,10.87 46.13,14.53 46.13,20.62 47.95,22.45 EMU_CONN.11
DATA_CONN1
  Top 0.203: DATA_BUFFER.17 41.86,9.65 42.67,9.65 46.53,13.51 46.53,18.59 47.95,20.02 EMU_CONN.12
DATA_CONN2
  Top 0.203: DATA_BUFFER.16 43.28,8.23 49.58,14.53 49.58,15.95 48.16,17.37 EMU_CONN.13
DATA_CONN3
  Top 0.203: DATA_BUFFER.15 41.86,7.01 46.13,7.01 47.35,8.23 53.85,8.23 60.55,14.93 63.19,14.93 EMU_CONN.15
DATA_CONN4
  Top 0.203: DATA_BUFFER.14 41.86,5.79 45.52,5.79 47.55,7.82 54.05,7.82 60.55,14.33 61.98,14.33 62.38,13.92 64.21,13.92 64.82,14.53 64.82,15.95 63.4,17.37 EMU_CONN.16
DATA_CONN5  (via drill 0.33)
  Top 0.203: v60.76,13.51 51,3.76 47.14,3.76 46.53,4.37 41.86,4.37 DATA_BUFFER.13
  Bottom 0.203: v60.76,13.51 60.76,17.58 63.19,20.02 EMU_CONN.17
DATA_CONN6
  Top 0.203: DATA_BUFFER.12 45.11,3.15 47.14,1.12 52.02,1.12 65.23,14.33 65.23,20.62 63.4,22.45 EMU_CONN.18
DATA_CONN7
  Top 0.203: DATA_BUFFER.11 41.86,1.73 45.92,1.73 46.94,0.71 52.22,0.71 65.63,14.12 65.63,22.86 63.4,25.09 EMU_CONN.19
DATA_SRAM0  (via drill 0.33)
  Top 0.203: v52.43,28.55 52.43,27.13 54.05,25.5 54.05,17.78 v51.61,15.34 | v33.53,11.89 31.9,11.89 DATA_BUFFER.2
  Bottom 0.203: v52.43,28.55 49.38,31.6 47.14,31.6 44.5,34.24 40.64,34.24 40.23,33.83 40.23,33.63 39.62,33.02 IC2.11 | v51.61,15.34 50.39,15.34 45.72,10.67 34.75,10.67 v33.53,11.89
DATA_SRAM1  (via drill 0.33)
  Top 0.203: v40.03,19 v40.03,24.49 | v35.56,12.9 33.53,10.87 31.9,10.87 DATA_BUFFER.3
  Bottom 0.203: v40.03,24.49 40.84,25.3 40.84,32.82 IC2.12 | v40.03,19 40.03,17.58 40.64,16.97 40.64,16.56 36.98,12.9 v35.56,12.9
DATA_SRAM2  (via drill 0.33)
  Top 0.203: v35.15,11.48 34.75,11.48 32.92,9.65 31.9,9.65 DATA_BUFFER.4
  Bottom 0.203: v35.15,11.48 35.36,11.28 37.19,11.28 46.94,21.03 49.17,21.03 51.21,23.06 51.21,29.16 49.17,31.19 46.94,31.19 46.33,30.58 42.87,30.58 42.27,31.19 42.27,32.82 IC2.13
DATA_SRAM3  (via drill 0.33)
  Top 0.203: v49.78,23.27 49.78,16.36 49.99,16.15 v49.99,13.31 | v33.93,9.45 33.53,9.45 32.31,8.23 DATA_BUFFER.5
  Bottom 0.203: v49.78,23.27 49.38,23.67 47.14,23.67 45.72,22.25 43.48,22.25 IC2.15 | v49.99,13.31 49.58,13.31 46.13,9.85 39.01,9.85 38.2,9.04 34.34,9.04 v33.93,9.45
DATA_SRAM4  (via drill 0.33)
  Top 0.203: v43.48,19.2 43.48,16.76 38,11.28 v38,9.85 | v35.36,9.85 32.51,7.01 31.9,7.01 DATA_BUFFER.6
  Bottom 0.203: v43.48,19.2 42.27,20.42 42.27,22.05 IC2.16 | v35.36,9.85 v38,9.85
DATA_SRAM5  (via drill 0.33)
  Top 0.203: v36.37,12.09 36.37,9.65 32.51,5.79 31.9,5.79 DATA_BUFFER.7
  Bottom 0.203: v36.37,12.09 36.78,12.09 41.05,16.36 41.05,22.05 IC2.17
DATA_SRAM6  (via drill 0.33)
  Top 0.203: v49.99,24.89 53.03,24.89 53.64,24.28 53.64,18.39 50.8,15.55 50.8,12.5 46.13,7.82 v43.89,7.82 | v35.15,7.01 32.71,4.57 31.9,4.57 DATA_BUFFER.8
  Bottom 0.203: v49.99,24.89 49.17,24.08 41.25,24.08 40.23,23.06 40.23,22.86 39.62,22.25 IC2.18 | v43.89,7.82 41.05,7.82 40.23,7.01 v35.15,7.01
DATA_SRAM7  (via drill 0.33)
  Top 0.203: v36.98,17.78 36.98,12.5 37.19,12.29 37.19,7.62 32.71,3.15 DATA_BUFFER.9
  Bottom 0.203: v36.98,17.78 38.2,19 38.2,22.05 IC2.19
GND  (via drill 0.33)
  Top 0.203: DATA_BUFFER.10 31.7,1.73 28.04,1.73 27.23,0.91 21.95,0.91 19.91,2.95 S4.2 19.71,3.15 15.85,3.15 | 7.11,9.04 7.11,13.92 7.31,14.12 C5.- | 7.11,9.04 IC1.1 7.11,8.84 | 11.58,25.91 11.58,26.92 ..22 | 11.58,25.91 13,24.49 C1.1 13.21,24.28 13.21,23.47 v14.02,22.66 | 11.58,25.91 10.16,25.91 9.55,25.3 9.55,25.09 8.94,24.49 C2.1 | 15.65,9.25 16.46,9.25 LED1.C 16.66,9.25 19.71,9.25 LED2.C | 15.65,9.25 13.41,9.25 LED3.C 13.21,9.04 12.19,9.04 | 15.65,9.25 15.65,14.53 C6.- | 12.19,9.04 7.11,9.04 | 15.85,3.15 13,5.99 12.6,5.99 12.19,6.4 12.19,9.04 | ADDRESS_LOW_BUFFER.10 41.86,30.17 v43.08,31.39 43.08,32.61 45.52,35.05 v45.52,35.46 | ..63 8.53,42.37 8.53,41.76 8.74,41.55 15.85,41.55 16.26,41.96 16.26,42.37 ..53 16.46,42.57 16.46,43.38 18.29,45.21 20.12,45.21 20.52,45.62 | 6.5,48.26 4.67,48.26 JP3.2 | 6.5,48.26 7.52,48.26 C3.2 7.72,48.26 8.74,49.28 12.39,49.28 13.41,48.26 14.43,48.26 C13.2 14.63,48.26 19.3,48.26 C4.2 19.51,48.06 20.52,47.04 20.52,45.62 | 40.03,47.85 33.32,47.85 32.71,48.46 30.48,48.46 26.82,44.81 26.82,41.96 25.6,40.74 JP2.3 25.4,40.74 20.52,45.62 | 40.03,47.85 41.66,47.85 ADDRESS_HI_AND_CTRL_BUFFER.10 | 40.03,47.85 v40.03,40.74 | 15.85,3.15 15.04,2.34 15.04,2.13 14.83,1.93 8.94,1.93 3.86,7.01 2.03,7.01 0.61,8.43 0.61,39.12 6.5,45.01 6.5,48.26
  Bottom 0.203: v14.02,22.66 14.02,16.36 15.65,14.73 C6.- 15.85,14.53 15.85,14.12 17.88,12.09 20.12,12.09 21.34,13.31 21.95,13.31 <-MISO.6 | v43.08,31.39 43.28,31.6 43.28,32.82 IC2.14 | EMU_CONN.14 48.16,15.14 48.16,15.55 51.61,19 51.61,26.72 53.24,28.35 53.24,32.21 49.17,36.27 46.33,36.27 v45.52,35.46 40.23,40.74 v40.03,40.74
  pour Top (isolate 0.254): 0.18,50.04 67.49,50.04 67.49,-0.13 0.18,-0.13
  pour Bottom (isolate 0.254): 0.18,50.04 66.85,50.04 66.85,-0.13 0.18,-0.13
MISO  (via drill 0.33)
  Top 0.203: 4.67,38.71 4.47,38.51 4.47,32.82 2.84,31.19 2.84,21.84 6.1,18.59 19.51,18.59 <-MISO.1 | 4.67,38.71 5.08,39.12 5.69,39.12 ..3 | 4.67,38.71 v4.47,38.91
  Bottom 0.203: v4.47,38.91 3.66,39.73 3.66,40.13 4.27,40.74 6.71,40.74 12.19,46.23 22.35,46.23 22.76,45.82 25.4,45.82 JP2.5
MOSI  (via drill 0.33)
  Top 0.203: ..2 5.69,39.93 v4.47,39.93 2.03,37.49 2.03,21.44 3.66,19.81 3.66,13.72 2.84,12.9 2.84,12.5 v3.66,11.68 | v24.99,9.25 24.99,12.29 22.15,15.14 22.15,15.75 <-MISO.4
  Bottom 0.203: v4.47,39.93 6.5,39.93 12.39,45.82 22.15,45.82 24.79,43.18 JP2.4 | v24.99,9.25 24.59,9.25 22.96,7.62 7.72,7.62 v3.66,11.68
N$1
  Top 0.203: 6.5,23.27 6.5,20.62 6.3,20.42 Y2.1 | 6.5,23.27 6.5,27.53 9.75,30.78 10.97,30.78 13.21,28.55 13.21,27.13 ..24 | 6.5,23.27 9.55,23.27 10.57,24.28 C2.2
N$2
  Top 0.203: ..23 12.39,26.92 12.39,26.31 13.21,25.5 13.82,25.5 14.83,24.49 C1.2 14.83,24.28 14.83,22.45 12.8,20.42 Y2.2
N$3
  Top 0.203: IC1.3 2.44,8.84 2.44,14.12 C5.+
  Bottom 0.203: 8.33,27.33 5.08,24.08 3.86,24.08 2.44,22.66 2.44,14.33 C5.+ | 8.33,27.33 11.38,30.38 D1.1 | 8.33,27.33 2.84,32.82 2.84,39.93 4.47,41.55 4.47,45.41 JP3.1
N$4
  Top 0.203: D3.1 58.32,47.65 62.99,47.65 63.19,47.85 EMU_CONN.28
N$5  (via drill 0.33)
  Top 0.203: v16.87,20.62 16.87,25.91 16.46,26.31 16.46,26.92 ..28 | v15.44,16.15 11.99,12.7 11.99,10.87 v10.97,9.85
  Bottom 0.203: v16.87,20.62 16.87,20.22 15.44,18.8 v15.44,16.15 | v10.97,9.85 11.38,9.85 13.21,8.03 22.76,8.03 26.62,11.89 30.48,11.89 34.14,8.23 40.23,8.23 41.45,9.45 49.58,9.45 49.99,9.85 50.39,9.85 51,9.25 51,5.99 50.6,5.59 JP1.1
N$6  (via drill 0.33)
  Top 0.203: v26.82,9.25 26.82,21.64 21.54,26.92 19.51,26.92 ..32 | v23.16,5.59 23.57,5.59 23.77,5.79 25.2,5.79 26.42,4.57 R2.1
  Bottom 0.203: v23.16,5.59 v26.82,9.25
N$7
  Top 0.203: R2.2 20.73,4.57 18.29,7.01 16.66,7.01 LED1.A
N$8
  Top 0.203: ..31 18.69,26.92 18.69,25.5 22.55,21.64 24.79,21.64 26.01,20.42 26.01,8.03 R3.1
N$10  (via drill 0.33)
  Top 0.203: v21.54,9.25 21.54,8.84 19.91,7.21 LED2.A | v23.16,10.26 23.16,9.85 24.18,8.84 24.18,8.03 R3.2
  Bottom 0.203: v21.54,9.25 22.15,9.25 v23.16,10.26
N$11  (via drill 0.33)
  Top 0.203: v22.76,20.02 17.88,24.89 17.88,26.92 ..30 | v23.37,12.5 23.37,11.89 22.15,10.67 22.15,10.26 23.16,9.25 23.16,7.01 23.98,6.2 26.62,6.2 27.43,5.38 27.43,3.15 26.42,2.13 R5.1
  Bottom 0.203: v22.76,20.02 22.76,19.61 23.37,19 v23.37,12.5
N$12
  Top 0.203: LED3.A 13.41,7.01 14.83,7.01 17.68,4.17 22.35,4.17 24.38,2.13 R5.2
N$13  (via drill 0.33)
  Top 0.203: v16.05,25.7 15.65,26.11 15.65,26.92 ..27
  Bottom 0.203: v16.05,25.7 13,22.66 13,14.73 10.97,12.7 9.55,12.7 9.14,12.29 5.08,12.29 3.86,13.51 3.45,13.51 2.84,12.9 2.84,11.48 9.55,4.77 27.63,4.77 29.87,7.01 34.14,7.01 35.56,5.59 JP1.2
OE_CONN  (via drill 0.33)
  Top 0.203: DATA_BUFFER.1 31.29,13.31 30.07,12.09 v30.07,11.07 | v50.19,9.04 50.19,11.28 61.77,22.86 61.77,31.19 63.19,32.61 EMU_CONN.22 63.4,32.82 64.82,34.24 64.82,48.46 64.21,49.07 47.14,49.07 44.7,46.63 41.66,46.63 ADDRESS_HI_AND_CTRL_BUFFER.9
  Bottom 0.203: v30.07,11.07 30.68,11.07 33.93,7.82 40.44,7.82 41.66,9.04 v50.19,9.04
RESET  (via drill 0.33)
  Top 0.203: v9.96,29.97 9.96,27.13 ..20 | v12.8,45.01 11.58,46.23 R4.1 | S4.1 13.21,3.15 8.33,3.15 4.06,7.42 3.86,7.42 3.66,7.62 3.66,10.67 4.47,11.48 4.47,13.72 7.72,16.97 v9.55,16.97 16.05,16.97 19.51,13.51 <-MISO.5
  Bottom 0.203: v9.96,29.97 9.96,31.39 11.18,32.61 | 11.18,32.61 13,34.44 13,36.47 14.02,37.49 14.02,43.79 v12.8,45.01 | 11.18,32.61 12.39,31.39 12.39,29.36 9.55,26.52 v9.55,16.97
SCK  (via drill 0.33)
  Top 0.203: v17.68,19.41 5.89,19.41 3.25,22.05 3.25,30.99 5.08,32.82 5.69,32.82 ..11
  Bottom 0.203: v17.68,19.41 17.68,17.78 19.51,15.95 <-MISO.3
SRAM_CE  (via drill 0.33)
  Top 0.203: v8.33,28.35 7.72,27.74 7.72,27.13 ..17 | v31.09,14.33 v34.54,17.78 | v3.66,12.7 3.66,13.11 4.06,13.51 4.06,20.02 2.44,21.64 2.44,31.8 v3.66,33.02
  Bottom 0.203: 8.33,32.82 8.33,36.47 9.14,37.29 9.14,38.71 8.13,39.73 AND_G:Q1.E | 8.33,32.82 v8.33,28.35 | v34.54,17.78 36.98,20.22 36.98,22.05 IC2.20 | v31.09,14.33 28.45,14.33 22.55,8.43 13.41,8.43 11.18,10.67 5.69,10.67 v3.66,12.7 | v3.66,33.02 4.88,33.02 5.08,32.82 8.33,32.82
SRAM_OE  (via drill 0.33)
  Top 0.203: v5.69,23.67 5.69,28.75 ..16 | v6.91,17.17 7.31,17.17 7.92,17.78 18.29,17.78 18.9,17.17 24.38,17.17 v25.2,16.36 | v31.7,16.97 33.32,18.59 v33.32,20.42 35.97,23.06 35.97,24.49 35.36,25.09 v35.36,27.33 | v36.58,29.16 36.58,43.38 32.31,47.65 31.7,47.65 ADDRESS_HI_AND_CTRL_BUFFER.11
  Bottom 0.203: v5.69,23.67 5.69,22.25 7.31,20.62 7.31,17.58 v6.91,17.17 | v25.2,16.36 31.09,16.36 v31.7,16.97 | v33.32,20.42 34.54,21.64 IC2.22 | v36.58,29.16 36.58,28.55 v35.36,27.33
SRAM_WE  (via drill 0.33)
  Top 0.203: v17.47,28.35 14.63,31.19 9.55,31.19 8.13,29.77 5.89,29.77 ..15 | v19.51,25.7 21.74,25.7 v23.98,23.47
  Bottom 0.203: v17.47,28.35 17.47,27.74 v19.51,25.7 | v23.98,23.47 27.23,23.47 28.04,22.66 28.04,22.25 IC2.27
VCC  (via drill 0.33)
  Top 0.203: v56.49,44.2 58.11,44.2 D3.2 | ADDRESS_HI_AND_CTRL_BUFFER.20 31.5,36.47 27.23,36.47 25.6,38.1 JP2.2 | DATA_BUFFER.20 41.86,14.53 45.72,18.39 45.72,22.25 47.55,24.08 v52.83,24.08 | C4.1 19.3,46.43 14.63,46.43 C13.1 14.43,46.43 12.8,48.06 11.58,48.06 R4.2 11.38,48.06 9.55,48.06 7.72,46.23 | 7.72,46.23 7.72,42.57 ..64 7.72,42.37 7.72,41.76 8.33,41.15 13.82,41.15 | 13.82,41.15 16.26,41.15 16.87,41.76 16.87,42.37 ..52 | 7.72,46.23 C3.1 | v24.59,20.83 22.15,18.39 <-MISO.2 | v29.87,18.8 31.7,18.8 ADDRESS_LOW_BUFFER.20 | v12.39,28.35 11.38,28.35 10.77,27.74 10.77,27.13 ..21 | IC1.2 4.88,8.84 4.88,13.51 7.11,15.75 9.55,15.75 10.57,14.73 C6.+ | v13.82,35.46 13.82,41.15
  Bottom 0.203: v56.49,44.2 55.68,44.2 53.03,46.84 42.47,46.84 | 42.47,46.84 34.34,46.84 25.81,38.3 | 25.81,38.3 25.6,38.1 JP2.2 25.81,38.3 | v52.83,24.08 52.83,25.5 54.05,26.72 54.05,33.83 48.56,39.32 43.28,39.32 42.47,40.13 42.47,46.84 | 26.62,22.05 25.81,22.05 v24.59,20.83 | 26.62,22.05 26.82,22.05 IC2.28 26.62,22.05 | 26.62,22.05 v29.87,18.8 | 15.04,32 15.04,33.83 15.24,34.04 | 15.04,32 15.04,30.58 D1.2 14.83,30.38 12.8,28.35 v12.39,28.35 12.39,23.67 9.96,21.23 9.96,17.58 10.57,16.97 10.57,14.73 C6.+ | 15.04,32 19.51,32 20.32,31.19 20.32,22.86 21.95,21.23 21.95,18.59 <-MISO.2 | 15.24,34.04 v13.82,35.46 | 15.24,34.04 AND_G:R7.1 15.44,34.24 16.46,35.26 16.46,37.49 21.13,42.16 22.55,42.16 23.16,41.55 23.16,40.95 25.81,38.3